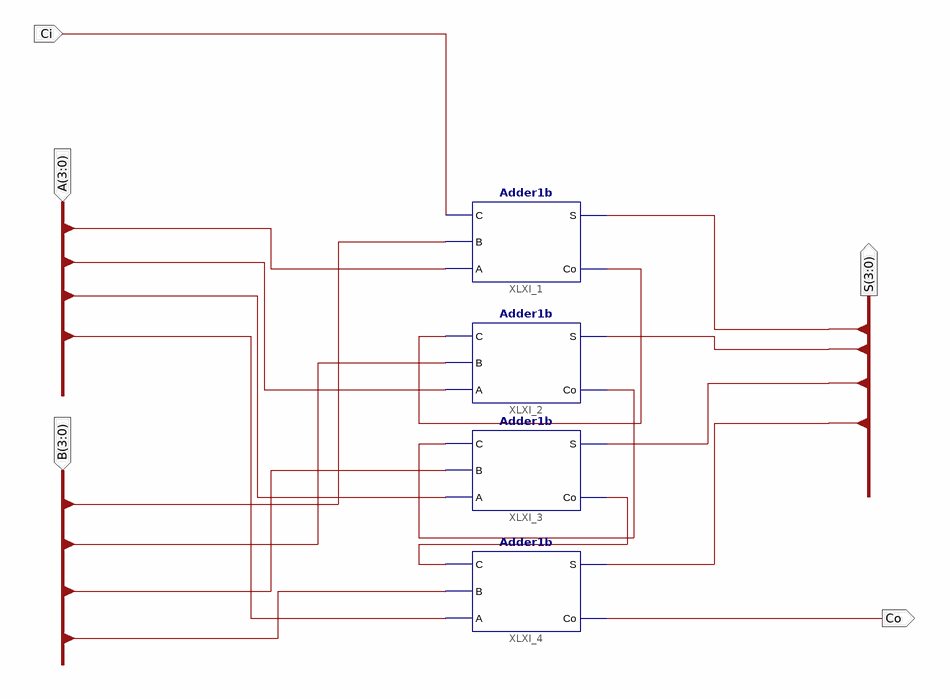
[diagram p0: schematic sheet 1]
// Xilinx ISE schematic Adder4b.sch (kintex7) as structural Verilog: 4 symbols, 5 ports
module Adder4b (
  input  [3:0] A,
  input  [3:0] B,
  input  Ci,
  output [3:0] S,
  output Co
);

  wire XLXN_16, XLXN_17, XLXN_18;

  Adder1b XLXI_1 (.C(Ci), .B(B[0]), .A(A[0]), .S(S[0]), .Co(XLXN_16));
  Adder1b XLXI_2 (.C(XLXN_16), .B(B[1]), .A(A[1]), .S(S[1]), .Co(XLXN_17));
  Adder1b XLXI_3 (.C(XLXN_17), .B(B[2]), .A(A[2]), .S(S[2]), .Co(XLXN_18));
  Adder1b XLXI_4 (.C(XLXN_18), .B(B[3]), .A(A[3]), .S(S[3]), .Co(Co));
endmodule
